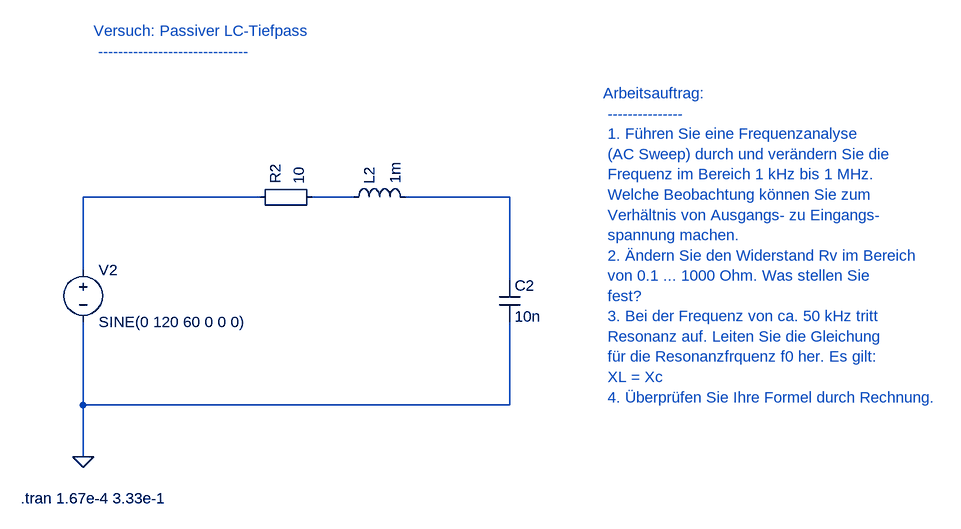
[diagram p0: schematic 10_4_Passiver_LC_Tiefpass.asc]
10_4_Passiver_LC_Tiefpass.asc, the LTspice schematic file:
Version 4
SHEET 1 880 680
WIRE 816 512 816 528
WIRE 160 512 160 528
WIRE 816 528 816 640
WIRE 816 640 160 640
WIRE 512 320 576 320
WIRE 160 432 160 320
WIRE 160 320 432 320
WIRE 160 640 160 720
WIRE 160 528 160 640
WIRE 656 320 816 320
WIRE 816 320 816 448
FLAG 160 720 0
SYMBOL Misc\EuropeanResistor 416 336 R270
SYMATTR InstName R2
SYMATTR Value 10
SYMBOL cap 800 448 R0
SYMATTR InstName C2
SYMATTR Value 10n
SYMBOL voltage 160 416 R0
SYMATTR InstName V2
SYMATTR Value SINE(0 120 60 0 0 0)
SYMBOL ind 560 336 R270
SYMATTR InstName L2
SYMATTR Value 1m
TEXT 64 784 Left 2 !.tran 1.67e-4 3.33e-1
TEXT 176 64 Left 2 ;Versuch: Passiver LC-Tiefpass \n ------------------------------
TEXT 960 160 Left 2 ;Arbeitsauftrag: \n --------------- \n 1. Führen Sie eine Frequenzanalyse \n (AC Sweep) durch und verändern Sie die \n Frequenz im Bereich 1 kHz bis 1 MHz. \n Welche Beobachtung können Sie zum \n Verhältnis von Ausgangs- zu Eingangs- \n spannung machen. \n 2. Ändern Sie den Widerstand Rv im Bereich \n von 0.1 ... 1000 Ohm. Was stellen Sie \n fest? \n 3. Bei der Frequenz von ca. 50 kHz tritt \n Resonanz auf. Leiten Sie die Gleichung \n für die Resonanzfrquenz f0 her. Es gilt: \n XL = Xc \n 4. Überprüfen Sie Ihre Formel durch Rechnung.

The netlist it stands for:
* 10_4_Passiver_LC_Tiefpass.asc
R2 N002 N001 10
C2 N003 0 10n
V2 N002 0 SINE(0 120 60 0 0 0)
L2 N001 N003 1m
.tran 1.67e-4 3.33e-1
* Versuch: Passiver LC-Tiefpass
*  ------------------------------
* Arbeitsauftrag:
*  ---------------
*  1. Führen Sie eine Frequenzanalyse
*  (AC Sweep) durch und verändern Sie die
*  Frequenz im Bereich 1 kHz bis 1 MHz.
*  Welche Beobachtung können Sie zum
*  Verhältnis von Ausgangs- zu Eingangs-
*  spannung machen.
*  2. Ändern Sie den Widerstand Rv im Bereich
*  von 0.1 ... 1000 Ohm. Was stellen Sie
*  fest?
*  3. Bei der Frequenz von ca. 50 kHz tritt
*  Resonanz auf. Leiten Sie die Gleichung
*  für die Resonanzfrquenz f0 her. Es gilt:
*  XL = Xc
*  4. Überprüfen Sie Ihre Formel durch Rechnung.
.backanno
.end